# EAGLE schematic sensors (EAGLE 7.2.0)
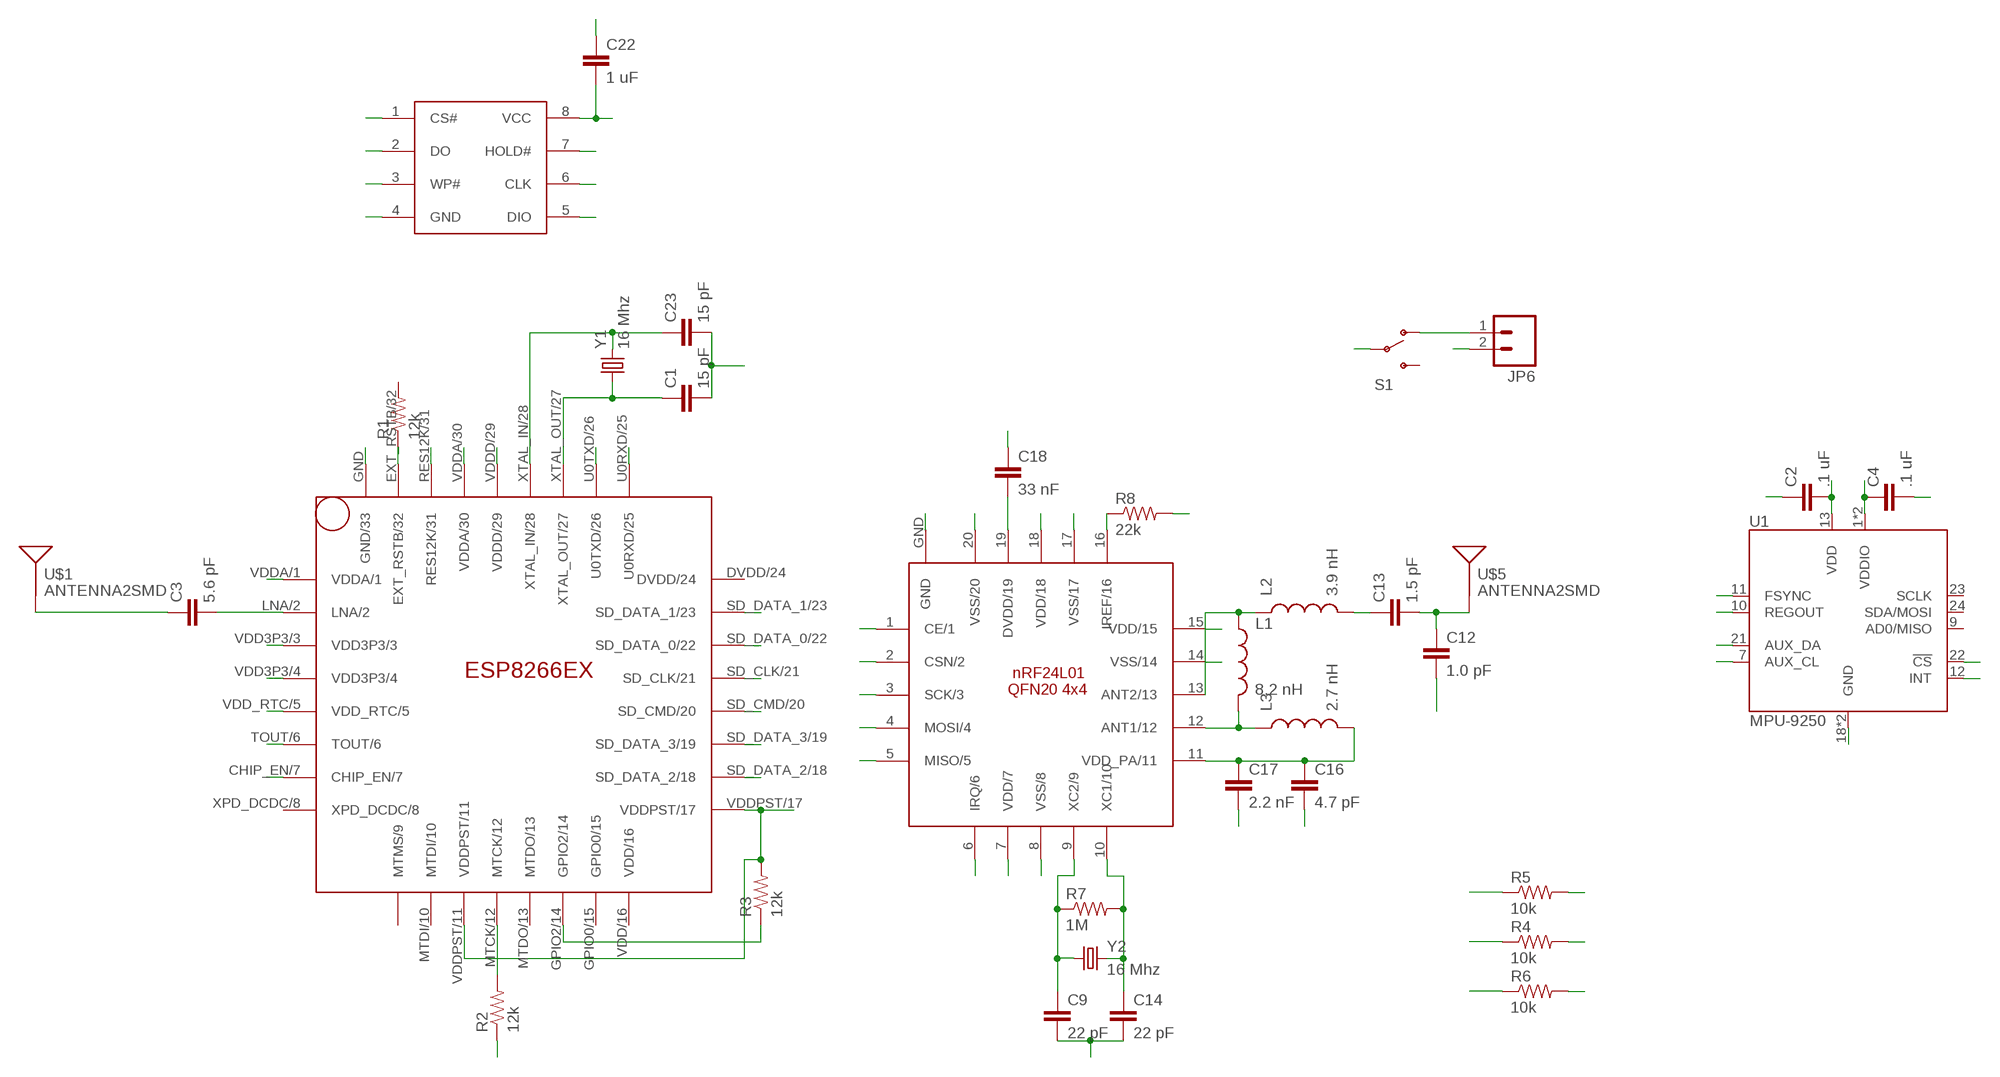
[diagram p0: schematic, sheet 1]

## Parts
C1  15 pF  CAP0603-CAP  [0603-CAP]
C2  .1 uF  CAP0603-CAP  [0603-CAP]
C3  5.6 pF  CAP0603-CAP  [0603-CAP]
C4  .1 uF  CAP0603-CAP  [0603-CAP]
C9  22 pF  CAP0603-CAP  [0603-CAP]
C12  1.0 pF  CAP0603-CAP  [0603-CAP]
C13  1.5 pF  CAP0603-CAP  [0603-CAP]
C14  22 pF  CAP0603-CAP  [0603-CAP]
C16  4.7 pF  CAP0603-CAP  [0603-CAP]
C17  2.2 nF  CAP0603-CAP  [0603-CAP]
C18  33 nF  CAP0603-CAP  [0603-CAP]
C22  1 uF  CAP0603-CAP  [0603-CAP]
C23  15 pF  CAP0603-CAP  [0603-CAP]
JP6  M02LOCK  [1X02_LOCK]
L1  8.2 nH  INDUCTOR0402  [C0402]
L2  3.9 nH  INDUCTOR0402  [C0402]
L3  2.7 nH  INDUCTOR0402  [C0402]
MESH  NRF24L01  [QFN20(4X4)]
R1  12k  RESISTOR0603-RES  [0603-RES]
R2  12k  RESISTOR0603-RES  [0603-RES]
R3  12k  RESISTOR0603-RES  [0603-RES]
R4  10k  RESISTOR0603-RES  [0603-RES]
R5  10k  RESISTOR0603-RES  [0603-RES]
R6  10k  RESISTOR0603-RES  [0603-RES]
R7  1M  RESISTOR0603-RES  [0603-RES]
R8  22k  RESISTOR0603-RES  [0603-RES]
S1  SWITCH-SPDT-SMD-A  [SWITCH-SPST-SMD-A]
U1  MPU-9250  [QFN-24/3MM]
U$1  ANTENNA2SMD  [ANTENNA-CHIP2]
U$2  25Q40  [SOP8]
U$5  ANTENNA2SMD  [ANTENNA-CHIP2]
WIFI  ESP8266EX  [QFN32]
Y1  16 Mhz  CRYSTAL5X3  [CRYSTAL-SMD-5X3]
Y2  16 Mhz  CRYSTAL5X3  [CRYSTAL-SMD-5X3]

## Nets
3.3V: C2.2 C4.1 C22.2 MESH.7(VDD/7) MESH.15(VDD/15) MESH.18(VDD/18) R3.2 U1.1(VDDIO) U1.8(VDDIO) U1.13(VDD) U$2.8(VCC) WIFI.CHIP_EN/7 WIFI.VDD3P3/3 WIFI.VDD3P3/4 WIFI.VDDA/1 WIFI.VDDD/29 WIFI.VDDPST/11 WIFI.VDDPST/17
CE: MESH.1(CE/1)
CSN: MESH.2(CSN/2)
GND: C1.2 C2.1 C4.2 C9.2 C12.2 C14.2 C16.2 C17.2 C18.1 C22.1 C23.2 JP6.2 MESH.8(VSS/8) MESH.14(VSS/14) MESH.17(VSS/17) MESH.20(VSS/20) R2.1 R8.2 U$2.4(GND) WIFI.GND(GND/33)
IQR: MESH.6(IRQ/6)
MISO: MESH.5(MISO/5)
MOSI: MESH.4(MOSI/4)
N$1: C3.1 U$1.FEED(SIGNAL)
N$2: R3.1 WIFI.GPIO2/14
N$3: R2.2 WIFI.MTCK/12
N$4: U1.11(FSYNC)
N$5: L1.2 L3.1 MESH.12(ANT1/12)
N$6: C13.1 L2.2
N$7: U1.10(REGOUT)
N$8: U1.21(AUX_DA)
N$9: U1.7(AUX_CL)
N$10: C12.1 C13.2 U$5.FEED(SIGNAL)
N$11: U1.18(GND) U1.20(GND)
N$12: U1.12(INT)
N$13: C3.2 WIFI.LNA/2
N$14: U1.22(!CS)
N$16: C9.1 MESH.9(XC2/9) R7.1 Y2.1
N$17: C14.1 MESH.10(XC1/10) R7.2 Y2.3
N$18: C16.1 C17.1 L3.2 MESH.11(VDD_PA/11)
N$19: L1.1 L2.1 MESH.13(ANT2/13)
N$24: MESH.16(IREF/16) R8.1
N$28: C18.2 MESH.19(DVDD/19)
N$30: MESH.GND
N$38: WIFI.RES12K/31
RST: R1.1 WIFI.EXT_RSTB/32
RTC: WIFI.VDD_RTC/5
RX_W: WIFI.U0TXD/26
SCK: MESH.3(SCK/3)
SCL: R4.2
SD-CLK: U$2.6(CLK) WIFI.SD_CLK/21
SD-CMD: U$2.1(CS#) WIFI.SD_CMD/20
SD-D0: U$2.2(DO) WIFI.SD_DATA_0/22
SD-D1: U$2.5(DIO) WIFI.SD_DATA_1/23
SD-D2: U$2.7(HOLD#) WIFI.SD_DATA_2/18
SD-D3: U$2.3(WP#) WIFI.SD_DATA_3/19
SDA: R5.2
SDO: R6.2
TOUT: WIFI.TOUT/6
TX_W: WIFI.U0RXD/25
VCC: JP6.1 S1.1(O)
VDD: R4.1 R5.1 R6.1 WIFI.VDDA/30
VRAW: S1.2(P)
XTAL_IN: C23.1 WIFI.XTAL_IN/28 Y1.3
XTAL_OUT: C1.1 WIFI.XTAL_OUT/27 Y1.1
Unconnected: R1.2 S1.3(S) U1.9(AD0/MISO) U1.23(SCLK) U1.24(SDA/MOSI) WIFI.DVDD/24 WIFI.GPIO0/15 WIFI.MTDI/10 WIFI.MTDO/13 WIFI.MTMS/9 WIFI.VDD/16 WIFI.XPD_DCDC/8

## Library data of the parts
C1-C4 C9 C12-C14 C16-C18 C22 C23 = SparkFun-Capacitors:CAP: Capacitor Standard 0603 ceramic capacitor, and 0.1" leaded capacitor.
JP6 = SparkFun-Connectors:M02: Standard 2-pin 0.1" header. Use with - straight break away headers ( PRT-00116) - right angle break away headers (PRT-00553) - swiss pins (PRT-00743) - machine pins (PRT-00117) - female headers (PRT-00115) Molex polarized connector foot print use with: PRT-08233 with associated crimp pins and housings. 2.54_SCREWTERM for use with PRT-10571. 3.5mm Screw Terminal footprints for PRT-08084 5mm Screw Terminal footprints for use with PRT-08432
L1-L3 = SparkFun-Passives:INDUCTOR: Inductors Basic Inductor/Choke - 0603 and 1206. Footprints are not proven and vary greatly between part numbers. INDUCTOR POWER 3.3UH 4.0A SMD 0.197" L x 0.197" W x 0.177" H (5.00mm x 5.00mm x 4.50mm)
MESH = RF:NRF24L01
R1-R8 = SparkFun-Resistors:RESISTOR: Resistor Basic schematic elements and footprints for 0603, 1206, and PTH resistors.
S1 = SparkFun-Electromechanical:SWITCH-SPDT: SPDT Switch Simple slide switch, Spark Fun Electronics SKU : COM-00102 DPDT SMT slide switch, AYZ0202, SWCH-08179
U1 = chips:MPU-9250: GYRO/ACCEL/COMPASS/9-AXIS; DIGIKEY: 1428-1019-1-ND
U$1 U$5 = SparkFun-RF:ANTENNA2: Chip antenna Single endded antenna. Common with smaller chip antennas. CHIP4 package is the GPS Chip Antenna SKU: GPS-08418. CHIP5 package is 2.4GHz chip antenna SKU: WRL-00144.
U$2 = wifi:25Q40
WIFI = wifi:ESP8266EX
Y1 Y2 = SparkFun-FreqCtrl:CRYSTAL: Various standard crystals. Proven footprints.; PROD_ID: XTAL-08218

## Net classes
1 USB: width 0.254 mm, drill 0.33 mm, clearance 0.159 mm
2 Top GND Pour: clearance 0.762 mm to class 1